# Altium project Multiple Buck Converter.PrjPcb
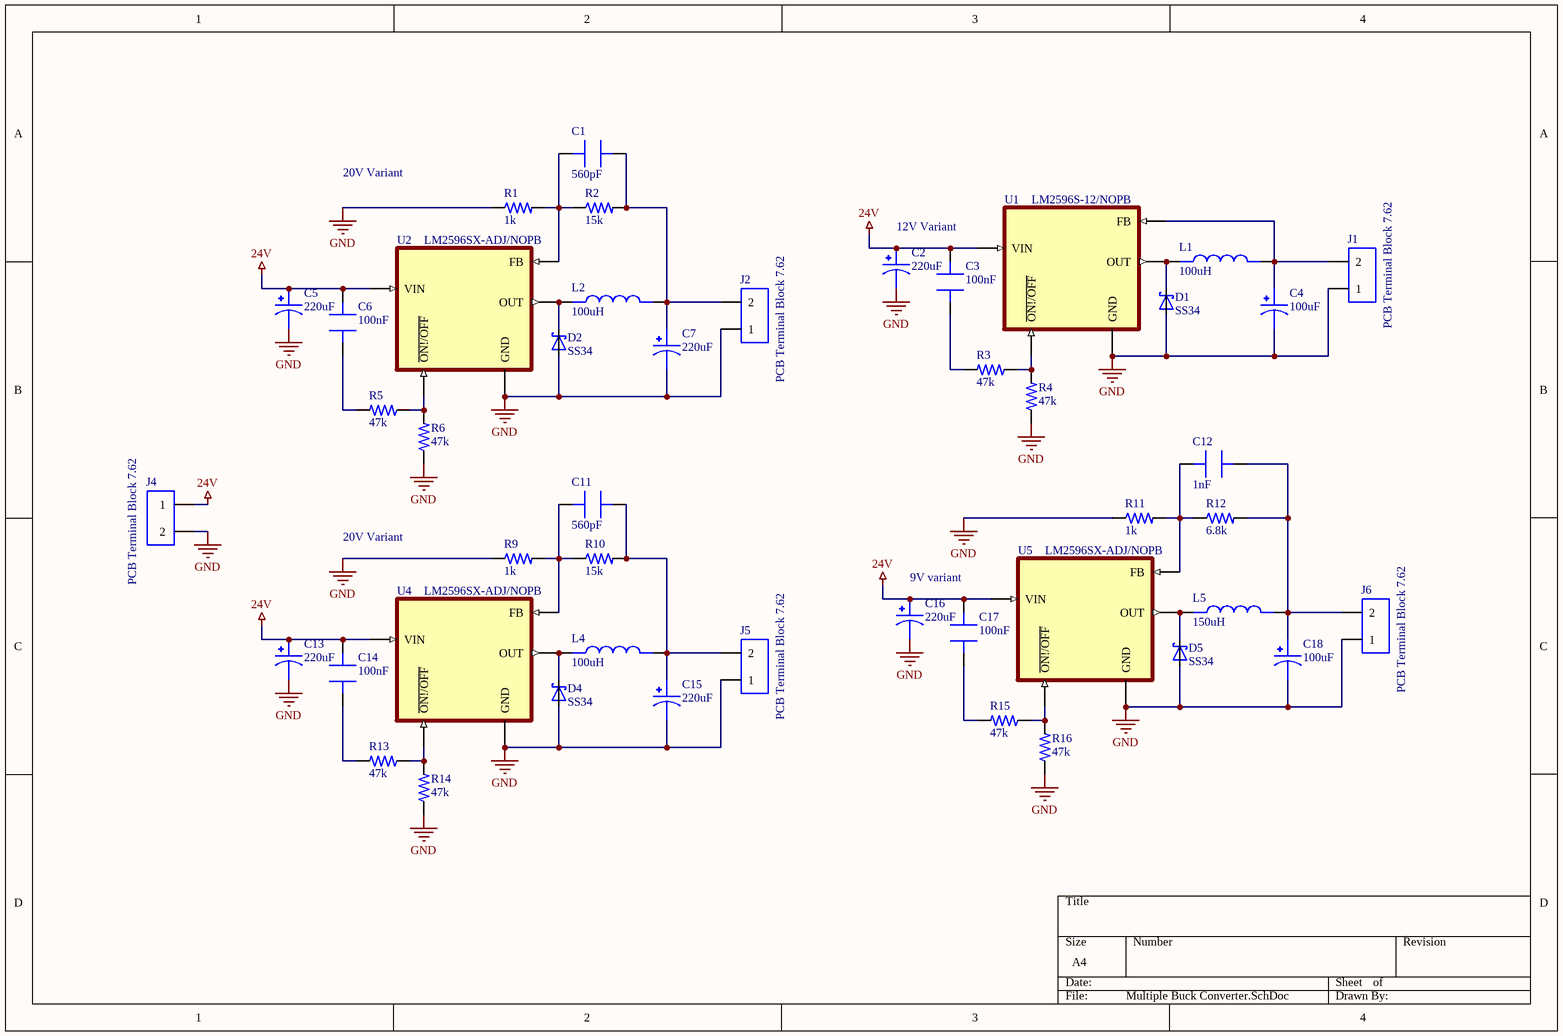
[diagram p0: Multiple Buck Converter.SchDoc]
1 sheet, 46 parts. Net scope: global (net labels, ports and power ports of the same name join across sheets).
Board file: Multiple Buck Converter.PcbDoc

## Sheet Multiple Buck Converter.SchDoc
size A4; SheetNumber: 1; SheetTotal: 1

### Parts
C1  560pF  [C0805]
C2  220uF  [CAPAE1030X1080N]
C3  100nF  [CAP_1206]
C4  100uF  [CAPPM7343X310N]
C5  220uF  [CAPAE1030X1080N]
C6  100nF  [CAP_1206]
C7  220uF  [CAPAE1030X1080N]
C11  560pF  [C0805]
C12  1nF  [CAP_1206]
C13  220uF  [CAPAE1030X1080N]
C14  100nF  [CAP_1206]
C15  220uF  [CAPAE1030X1080N]
C16  220uF  [CAPAE1030X1080N]
C17  100nF  [CAP_1206]
C18  100uF  [CAPPM6032X280N]
D1  SS34  [SS34-1]
D2  SS34  [SS34-1]
D4  SS34  [SS34-1]
D5  SS34  [SS34-1]
J1  PCB Terminal Block 7.62  [KF25C-7.62-2P]
J2  PCB Terminal Block 7.62  [KF25C-7.62-2P]
J4  PCB Terminal Block 7.62  [KF25C-7.62-2P]
J5  PCB Terminal Block 7.62  [KF25C-7.62-2P]
J6  PCB Terminal Block 7.62  [KF25C-7.62-2P]
L1  100uH  [DS1207]
L2  100uH  [DS1207]
L4  100uH  [DS1207]
L5  150uH  [DS1207]
R1  1k  [RES_1206]
R2  15k  [RES_1206]
R3  47k  [RES_1206]
R4  47k  [RES_1206]
R5  47k  [RES_1206]
R6  47k  [RES_1206]
R9  1k  [RES_1206]
R10  15k  [RES_1206]
R11  1k  [RES_1206]
R12  6.8k  [RES_1206]
R13  47k  [RES_1206]
R14  47k  [RES_1206]
R15  47k  [RES_1206]
R16  47k  [RES_1206]
U1  LM2596S-12/NOPB  [VREG_LM2596SX-ADJ/NOPB]
U2  LM2596SX-ADJ/NOPB  [VREG_LM2596SX-ADJ/NOPB]
U4  LM2596SX-ADJ/NOPB  [VREG_LM2596SX-ADJ/NOPB]
U5  LM2596SX-ADJ/NOPB  [VREG_LM2596SX-ADJ/NOPB]

### Nets
24V: C2.1 C3.1(PIN1) C5.1 C6.1(PIN1) C13.1 C14.1(PIN1) C16.1 C17.1(PIN1) J4.1 U1.1(VIN) U2.1(VIN) U4.1(VIN) U5.1(VIN)
GND: C2.2 C4.2 C5.2 C7.2 C13.2 C15.2 C16.2 C18.2 D1.A D2.A D4.A D5.A J1.1 J2.1 J4.2 J5.1 J6.1 R1.1 R4.1 R6.1 R9.1 R11.1 R14.1 R16.1 U1.3(GND) U2.3(GND) U4.3(GND) U5.3(GND)
NetC1_1: C1.1(PIN1) C7.1 J2.2 L2.2 R2.2
NetC1_2: C1.2(PIN2) R1.2 R2.1 U2.4(FB)
NetC3_2: C3.2(PIN2) R3.2
NetC4_1: C4.1 J1.2 L1.2 U1.4(FB)
NetC6_2: C6.2(PIN2) R5.2
NetC11_1: C11.1(PIN1) C15.1 J5.2 L4.2 R10.2
NetC11_2: C11.2(PIN2) R9.2 R10.1 U4.4(FB)
NetC12_1: C12.1(PIN1) C18.1 J6.2 L5.2 R12.2
NetC12_2: C12.2(PIN2) R11.2 R12.1 U5.4(FB)
NetC14_2: C14.2(PIN2) R13.2
NetC17_2: C17.2(PIN2) R15.2
NetD1_C: D1.C L1.1 U1.2(OUT)
NetD2_C: D2.C L2.1 U2.2(OUT)
NetD4_C: D4.C L4.1 U4.2(OUT)
NetD5_C: D5.C L5.1 U5.2(OUT)
NetR3_1: R3.1 R4.2 U1.5(~{ON!/OFF})
NetR5_1: R5.1 R6.2 U2.5(~{ON!/OFF})
NetR13_1: R13.1 R14.2 U4.5(~{ON!/OFF})
NetR15_1: R15.1 R16.2 U5.5(~{ON!/OFF})

### Notes on the sheet
- 20V Variant
- (near C2) 12V Variant
- (near C16) 9V variant

### Library data of the parts
C1 C11 = CC0805GRNPO0BN561: 100V 560pF NP0 ±2% 0805 Multilayer Ceramic Capacitors MLCC - SMD/SMT ROHS; Manufacturer: YAGEO; Manufacturer Part Number: CC0805GRNPO0BN561; Package: 0805; Value: 560pF; ComponentLink1Description: LCSC; ComponentLink1URL: https://www.lcsc.com/product-detail/Multilayer-Ceramic-Capacitors-MLCC-SMD-SMT_YAGEO-CC0805GRNPO0BN561_C527197.html
C2 C5 C7 C13 C15 C16 = UUD1H221MNL1GS: -45℃~+105℃ 5000hrs@105℃ 220uF 10mm 50V 10mm ±20% SMD,D10xL10mm Aluminum Electrolytic Capacitors - SMD ROHS; Manufacturer: Nichicon; Package: SMD,D10xL10mm; Value: 220uF; Manufacturer Part Number: UUD1H221MNL1GS; ComponentLink1Description: LCSC; ComponentLink1URL: https://www.lcsc.com/product-detail/Aluminum-Electrolytic-Capacitors-SMD_Nichicon-UUD1H221MNL1GS_C125976.html
C3 C6 C14 C17 = CC1206KRX7R9BB104: 50V 100nF X7R ±10% 1206 Multilayer Ceramic Capacitors MLCC - SMD/SMT ROHS; Manufacturer: YAGEO; Manufacturer Part Number: CC1206KRX7R9BB104; Package: 1206; Value: 100nF; ComponentLink1Description: LCSC; ComponentLink1URL: https://www.lcsc.com/product-detail/Multilayer-Ceramic-Capacitors-MLCC-SMD-SMT_YAGEO-CC1206KRX7R9BB104_C82601.html
C4 = TPSD107K010R0050: 100uF 10V -55℃~+125℃ 50mΩ@100kHz ±10% CASE-D_7343 Tantalum Capacitors ROHS; Manufacturer: Kyocera AVX; Value: 100uF; Package: CASE-D_7343; Manufacturer Part Number: TPSD107K010R0050; ComponentLink1Description: LCSC; ComponentLink1URL: https://www.lcsc.com/product-detail/Tantalum-Capacitors_Kyocera-AVX-TPSD107K010R0050_C313070.html
C12 = CC1206KKX7RDBB102: 2kV 1nF X7R ±10% 1206 Multilayer Ceramic Capacitors MLCC - SMD/SMT ROHS; Manufacturer: YAGEO; Manufacturer Part Number: CC1206KKX7RDBB102; Package: 1206; Value: 1nF; ComponentLink1Description: LCSC; ComponentLink1URL: https://www.lcsc.com/product-detail/Multilayer-Ceramic-Capacitors-MLCC-SMD-SMT_YAGEO-CC1206KKX7RDBB102_C23631.html
C18 = CA45-C016M107T: 100uF 16V -55℃~+125℃ 1Ω@100kHz ±20% CASE-C_6032 Tantalum Capacitors ROHS; Manufacturer: Hunan Xiangyee in S&T; Manufacturer Part Number: CA45-C016M107T; Package: CASE-C_6032; Value: 100uF; ComponentLink1Description: LCSC; ComponentLink1URL: https://www.lcsc.com/product-detail/Tantalum-Capacitors_Hunan-Xiangyee-in-S-T-CA45-C016M107T_C169226.html
D1 D2 D4 D5 = SS34: 0.5mA@40V 40V Single 3A 0.55V@3A SMA(DO-214AC) Schottky Barrier Diodes (SBD) ROHS; Manufacturer: MDD (Microdiode Electronics); Manufacturer Part Number: SS34; Package: SMA(DO-214AC)
J1 J2 J4-J6 = KF25C-7.62-2P: 24A -40℃~+105℃ 250V Black Midfoot Double - Walled(Double) 12~22 Straight pin 2 1 7.62mm 2.5 Straight,P=7.62mm Barrier Terminal Blocks ROHS; Manufacturer: Cixi Kefa Elec; Manufacturer Part Number: KF25C-7.62-2P; Package: Straight, P=7.62-2P; ComponentLink1Description: LCSC; ComponentLink1URL: https://www.lcsc.com/product-detail/Barrier-Terminal-Blocks_Cixi-Kefa-Elec-KF25C-7-62-2P_C707361.html
L1 L2 L4 = DS1207_100uH: Shielded Inductor DS1207 100uH; Manufacturer: SPORTON; Manufacturer Part Number: SDS127; Package: SMD; Value: 100uH
L5 = DS1207_150uH: Shielded Inductor DS1207 47uH; Manufacturer: SPORTON; Manufacturer Part Number: SDS127; Package: SMD; Value: 150uH
R1 R9 R11 = RC1206FR-071KL: 250mW Thick Film Resistors 200V ±100ppm/℃ ±1% -55℃~+155℃ 1kΩ 1206 Chip Resistor - Surface Mount ROHS; Manufacturer: YAGEO; Manufacturer Part Number: RC1206FR-071KL; Value: 1k; Package: 1206; ComponentLink1Description: LCSC; ComponentLink1URL: https://www.lcsc.com/product-detail/Chip-Resistor-Surface-Mount_YAGEO-RC1206FR-071KL_C131398.html
R2 R10 = RC1206FR-0715KL: 250mW Thick Film Resistors 200V ±100ppm/℃ ±1% -55℃~+155℃ 17.4Ω 1206 Chip Resistor - Surface Mount ROHS; Manufacturer: YAGEO; Manufacturer Part Number: RC1206FR-0715KL; Value: 15k; Package: 1206; ComponentLink1Description: LCSC; ComponentLink1URL: https://www.lcsc.com/product-detail/Chip-Resistor-Surface-Mount_YAGEO-RC1206FR-0715KL_C114932.html
R3-R6 R13-R16 = RC1206FR-0747KL: 250mW Thick Film Resistors 200V ±100ppm/℃ ±1% -55℃~+155℃ 47kΩ 1206 Chip Resistor - Surface Mount ROHS; Manufacturer: YAGEO; Manufacturer Part Number: RC1206FR-0747KL; Value: 47k; Package: 1206; ComponentLink1Description: LCSC; ComponentLink1URL: https://www.lcsc.com/product-detail/Chip-Resistor-Surface-Mount_YAGEO-RC1206FR-0747KL_C137270.html
R12 = RC1206FR-076K8L: 250mW Thick Film Resistors 200V ±100ppm/℃ ±1% -55℃~+155℃ 6.8kΩ 1206 Chip Resistor - Surface Mount ROHS; Manufacturer: YAGEO; Manufacturer Part Number: RC1206FR-076K8L; Value: 6.8k; Package: 1206; ComponentLink1Description: LCSC; ComponentLink1URL: https://www.lcsc.com/product-detail/Chip-Resistor-Surface-Mount_YAGEO-RC1206FR-076K8L_C246053.html
U1 = LM2596SX-ADJ/NOPB: NO Step-down type -40℃~+125℃@(TJ) 1 Step-down Fixed 12V 3A 4.5V~40V 150kHz TO-263-5 DC-DC Converters ROHS; Manufacturer: Texas Instruments; Package: TO-263; Manufacturer Part Number: LM2596S-12/NOPB; ComponentLink1Description: LCSC; ComponentLink1URL: https://www.lcsc.com/product-detail/DC-DC-Converters_Texas-Instruments-LM2596S-12-NOPB_C95366.html
U2 U4 U5 = LM2596SX-ADJ/NOPB: SIMPLE SWITCHER&reg; 4.5V to 40V, 3A Low Component Count Step-Down Regulator 5-DDPAK/TO-263 -40 to 125; Manufacturer: UMW(Youtai Semiconductor Co., Ltd.); Manufacturer Part Number: LM2596S-ADJ; Package: TO-263; ComponentLink1Description: LCSC; ComponentLink1URL: https://www.lcsc.com/product-detail/DC-DC-Converters_UMW-Youtai-Semiconductor-Co-Ltd-LM2596S-ADJ_C347423.html